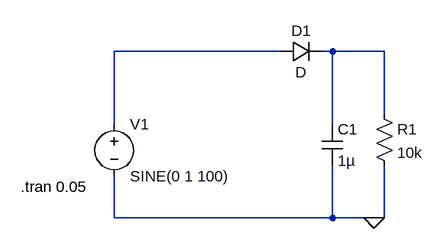
[diagram p0: schematic LTSpice 2.asc]
LTSpice 2.asc, the LTspice schematic file:
Version 4
SHEET 1 880 680
WIRE 80 -464 -176 -464
WIRE 160 -464 144 -464
WIRE 240 -464 160 -464
WIRE 240 -368 240 -464
WIRE -176 -352 -176 -464
WIRE 160 -352 160 -464
WIRE -176 -208 -176 -272
WIRE 160 -208 160 -288
WIRE 160 -208 -176 -208
WIRE 224 -208 160 -208
WIRE 240 -208 240 -288
WIRE 240 -208 224 -208
FLAG 224 -208 0
SYMBOL voltage -176 -368 R0
WINDOW 123 0 0 Left 0
WINDOW 39 0 0 Left 0
SYMATTR InstName V1
SYMATTR Value SINE(0 1 100)
SYMBOL diode 80 -448 R270
WINDOW 0 32 32 VTop 2
WINDOW 3 0 32 VBottom 2
SYMATTR InstName D1
SYMBOL res 224 -384 R0
SYMATTR InstName R1
SYMATTR Value 10k
SYMBOL cap 144 -352 R0
SYMATTR InstName C1
SYMATTR Value 1µ
TEXT -320 -256 Left 2 !.tran 0.05

The netlist it stands for:
* LTSpice 2.asc
V1 N001 0 SINE(0 1 100)
D1 N001 N002 D
R1 N002 0 10k
C1 N002 0 1µ
.model D D
.lib standard.dio
.tran 0.05
.backanno
.end